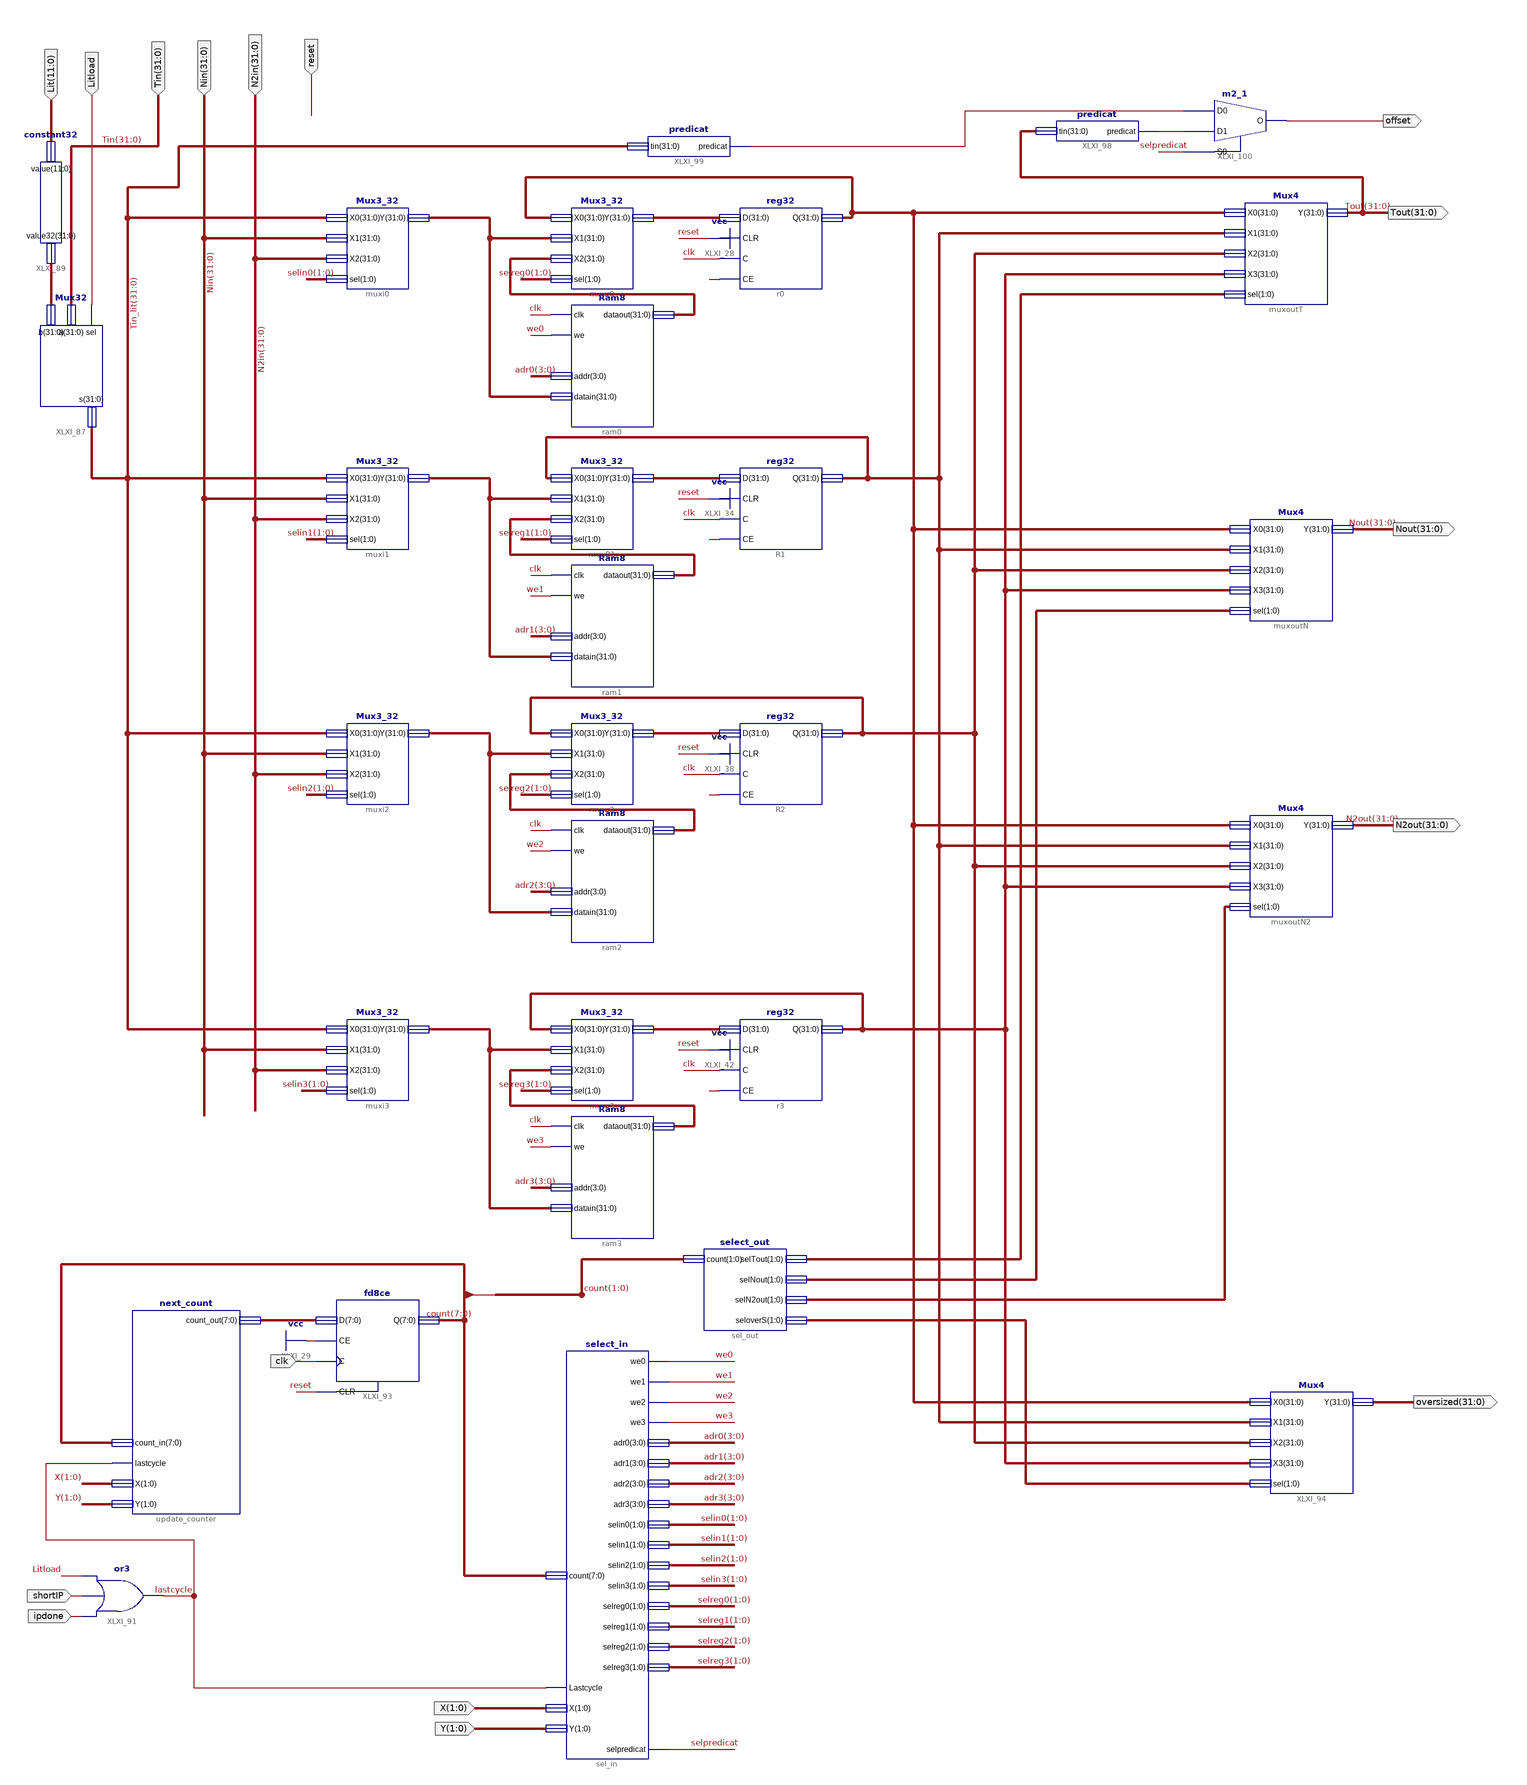
[diagram p0: schematic sheet 1]
// Xilinx ISE schematic stacknew.sch (spartan6) as structural Verilog: 30 symbols, 16 ports
module stacknew (
  input  [31:0] Nin,
  input  [31:0] N2in,
  input  clk,
  input  reset,
  input  Litload,
  input  [31:0] Tin,
  input  [11:0] Lit,
  input  ipdone,
  input  shortIP,
  input  [1:0] X,
  input  [1:0] Y,
  output [31:0] Tout,
  output [31:0] Nout,
  output [31:0] N2out,
  output [31:0] oversized,
  output offset
);

  wire lastcycle, selpredicat, we0, we1, we2, we3, XLXN_242, XLXN_243;
  wire [1:0] selin0, selin1, selin2, selin3, selreg0, selreg1, selreg2, selreg3, XLXN_71, XLXN_82, XLXN_83,
       XLXN_223;
  wire [3:0] adr0, adr1, adr2, adr3;
  wire [7:0] count, XLXN_31;
  wire [31:0] Tin_lit, XLXN_15, XLXN_17, XLXN_26, XLXN_33, XLXN_34, XLXN_39, XLXN_40, XLXN_41, XLXN_46,
       XLXN_47, XLXN_48, XLXN_53, XLXN_219, XLXN_224, XLXN_225, XLXN_226, XLXN_227;

  Mux3_32 muxi0 (.X0(Tin_lit), .X1(Nin), .X2(N2in), .sel(selin0), .Y(XLXN_26));
  Ram8 ram0 (.clk(clk), .we(we0), .addr(adr0), .datain(XLXN_26), .dataout(XLXN_17));
  Mux3_32 muxi1 (.X0(Tin_lit), .X1(Nin), .X2(N2in), .sel(selin1), .Y(XLXN_39));
  Mux3_32 muxi2 (.X0(Tin_lit), .X1(Nin), .X2(N2in), .sel(selin2), .Y(XLXN_46));
  Mux3_32 muxi3 (.X0(Tin_lit), .X1(Nin), .X2(N2in), .sel(selin3), .Y(XLXN_53));
  Mux3_32 muxr0 (.X0(XLXN_224), .X1(XLXN_26), .X2(XLXN_17), .sel(selreg0), .Y(XLXN_15));
  reg32 r0 (.D(XLXN_15), .CLR(reset), .C(clk), .CE(1'b1), .Q(XLXN_224));
  Ram8 ram1 (.clk(clk), .we(we1), .addr(adr1), .datain(XLXN_39), .dataout(XLXN_34));
  Mux3_32 muxR1 (.X0(XLXN_225), .X1(XLXN_39), .X2(XLXN_34), .sel(selreg1), .Y(XLXN_33));
  reg32 R1 (.D(XLXN_33), .CLR(reset), .C(clk), .CE(1'b1), .Q(XLXN_225));
  Ram8 ram2 (.clk(clk), .we(we2), .addr(adr2), .datain(XLXN_46), .dataout(XLXN_41));
  Mux3_32 muxr2 (.X0(XLXN_226), .X1(XLXN_46), .X2(XLXN_41), .sel(selreg2), .Y(XLXN_40));
  reg32 R2 (.D(XLXN_40), .CLR(reset), .C(clk), .CE(1'b1), .Q(XLXN_226));
  Ram8 ram3 (.clk(clk), .we(we3), .addr(adr3), .datain(XLXN_53), .dataout(XLXN_48));
  Mux3_32 muxr3 (.X0(XLXN_227), .X1(XLXN_53), .X2(XLXN_48), .sel(selreg3), .Y(XLXN_47));
  reg32 r3 (.D(XLXN_47), .CLR(reset), .C(clk), .CE(1'b1), .Q(XLXN_227));
  Mux4 muxoutT (.X0(XLXN_224), .X1(XLXN_225), .X2(XLXN_226), .X3(XLXN_227), .sel(XLXN_71), .Y(Tout));
  Mux4 muxoutN (.X0(XLXN_224), .X1(XLXN_225), .X2(XLXN_226), .X3(XLXN_227), .sel(XLXN_82), .Y(Nout));
  Mux4 muxoutN2 (.X0(XLXN_224), .X1(XLXN_225), .X2(XLXN_226), .X3(XLXN_227), .sel(XLXN_83), .Y(N2out));
  select_in sel_in (
    .Lastcycle(lastcycle), .count(count), .X(X), .Y(Y), .we0(we0), .we1(we1), .we2(we2), .we3(we3),
    .adr0(adr0), .adr1(adr1), .adr2(adr2), .adr3(adr3), .selin0(selin0), .selin1(selin1), .selin2(selin2),
    .selin3(selin3), .selreg0(selreg0), .selreg1(selreg1), .selreg2(selreg2), .selreg3(selreg3),
    .selpredicat(selpredicat));
  next_count update_counter (.lastcycle(lastcycle), .count_in(count), .X(X), .Y(Y), .count_out(XLXN_31));
  select_out sel_out (
    .count(count[1:0]), .selTout(XLXN_71), .selNout(XLXN_82), .selN2out(XLXN_83), .seloverS(XLXN_223));
  Mux32 XLXI_87 (.sel(Litload), .a(Tin), .b(XLXN_219), .s(Tin_lit));
  constant32 XLXI_89 (.value(Lit), .value32(XLXN_219));
  or XLXI_91 (lastcycle, ipdone, shortIP, Litload);
  fd8ce XLXI_93 (.C(clk), .CE(1'b1), .CLR(reset), .D(XLXN_31), .Q(count));
  Mux4 XLXI_94 (.X0(XLXN_224), .X1(XLXN_225), .X2(XLXN_226), .X3(XLXN_227), .sel(XLXN_223), .Y(oversized));
  predicat XLXI_98 (.tin(Tout), .predicat(XLXN_242));
  predicat XLXI_99 (.tin(Tin_lit), .predicat(XLXN_243));
  m2_1 XLXI_100 (.D0(XLXN_243), .D1(XLXN_242), .S0(selpredicat), .O(offset));
endmodule
